# Altium project sonar_board_rev_2013A.PrjPcb
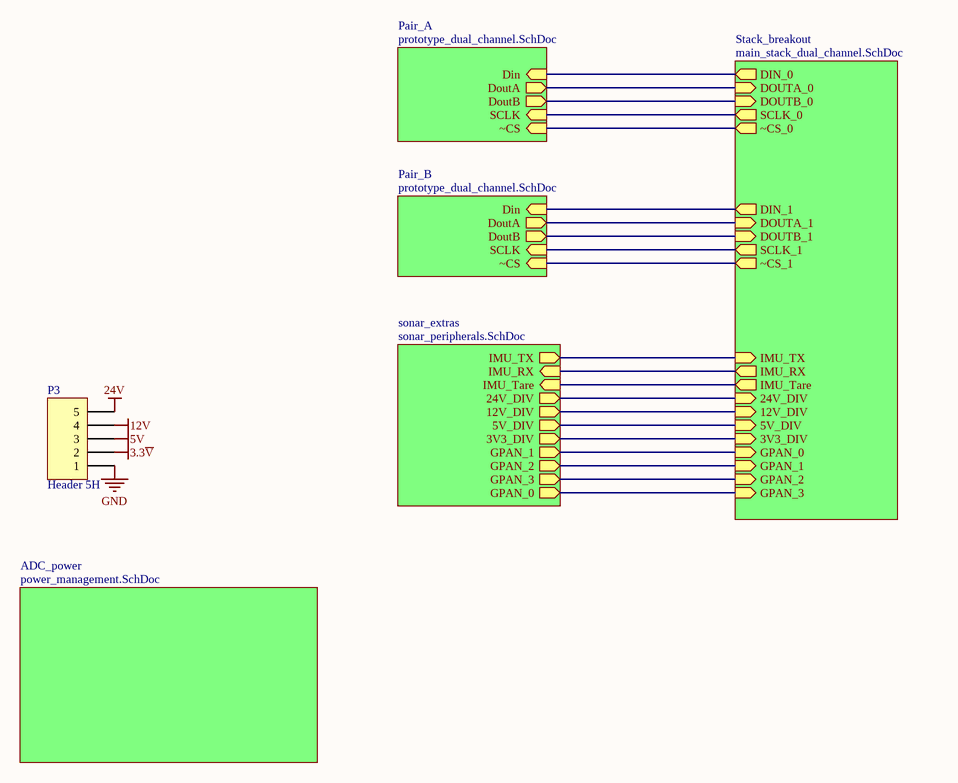
[diagram p0: sonar_board_rev_2013A.SchDoc]
8 sheets, 151 parts. Net scope: hierarchical (ports join the sheet entries above them; power ports are global).
Sheets:
  sonar_board_rev_2013A.SchDoc
    Pair_A = prototype_dual_channel.SchDoc
      Single_channel_VMA = voltage_mode_preamplifier.SchDoc
      Single_channel_VMA2 = voltage_mode_preamplifier.SchDoc
      Sallen_key_LPF = Sallen_key_LPF.SchDoc
      Biasing_circuitry = bias_LNA.SchDoc
      Sallen_key_LPF = Sallen_key_LPF.SchDoc
      Biasing_circuitry = bias_LNA.SchDoc
    Pair_B = prototype_dual_channel.SchDoc
      Single_channel_VMA = voltage_mode_preamplifier.SchDoc
      Single_channel_VMA2 = voltage_mode_preamplifier.SchDoc
      Sallen_key_LPF = Sallen_key_LPF.SchDoc
      Biasing_circuitry = bias_LNA.SchDoc
      Sallen_key_LPF = Sallen_key_LPF.SchDoc
      Biasing_circuitry = bias_LNA.SchDoc
    Stack_breakout = main_stack_dual_channel.SchDoc
    ADC_power = power_management.SchDoc
    sonar_extras = sonar_peripherals.SchDoc

## Sheet sonar_board_rev_2013A.SchDoc
size A

### Parts
P3  Header 5H  [HDR1X5H]

### Sub-sheets
ADC_power = power_management.SchDoc: no entries
Pair_A = prototype_dual_channel.SchDoc: Din (in), DoutA (out), DoutB (out), SCLK (in), ~CS (in)
Pair_B = prototype_dual_channel.SchDoc: SCLK (in), ~CS (in), DoutA (out), DoutB (out), Din (in)
sonar_extras = sonar_peripherals.SchDoc: IMU_TX (out), IMU_RX (in), IMU_Tare (in), 24V_DIV (out), 12V_DIV (out), 5V_DIV (out), 3V3_DIV (out), GPAN_1 (out), GPAN_2 (out), GPAN_3 (out), GPAN_0 (out)
Stack_breakout = main_stack_dual_channel.SchDoc: DIN_0 (out), DIN_1 (out), DOUTA_0 (in), DOUTA_1 (in), DOUTB_0 (in), DOUTB_1 (in), SCLK_0 (out), SCLK_1 (out), ~CS_0 (out), ~CS_1 (out), IMU_TX (in), IMU_RX (out), IMU_Tare (out), 24V_DIV (in), 12V_DIV (in), 5V_DIV (in), 3V3_DIV (in), GPAN_1 (in), GPAN_3 (in), GPAN_0 (in), GPAN_2 (in)

### Nets
3.3~{V}: P3.2
5V: P3.3
12V: P3.4
24V: P3.5
GND: P3.1
NetADC1_Pair_A_23: sheet Pair_A/Din, sheet Stack_breakout/DIN_0
NetADC1_Pair_A_31: sheet Pair_A/DoutB, sheet Stack_breakout/DOUTB_0
NetADC1_Pair_A_32: sheet Pair_A/DoutA, sheet Stack_breakout/DOUTA_0
NetADC1_Pair_A_34: sheet Pair_A/SCLK, sheet Stack_breakout/SCLK_0
NetADC1_Pair_A_35: sheet Pair_A/~CS, sheet Stack_breakout/~CS_0
NetADC1_Pair_B_23: sheet Pair_B/Din, sheet Stack_breakout/DIN_1
NetADC1_Pair_B_31: sheet Pair_B/DoutB, sheet Stack_breakout/DOUTB_1
NetADC1_Pair_B_32: sheet Pair_B/DoutA, sheet Stack_breakout/DOUTA_1
NetADC1_Pair_B_34: sheet Pair_B/SCLK, sheet Stack_breakout/SCLK_1
NetADC1_Pair_B_35: sheet Pair_B/~CS, sheet Stack_breakout/~CS_1
NetC25_2: sheet Stack_breakout/GPAN_3, sheet sonar_extras/GPAN_0
NetC26_2: sheet Stack_breakout/24V_DIV, sheet sonar_extras/24V_DIV
NetC27_2: sheet Stack_breakout/GPAN_0, sheet sonar_extras/GPAN_1
NetC28_2: sheet Stack_breakout/12V_DIV, sheet sonar_extras/12V_DIV
NetC29_2: sheet Stack_breakout/GPAN_1, sheet sonar_extras/GPAN_2
NetC30_2: sheet Stack_breakout/5V_DIV, sheet sonar_extras/5V_DIV
NetC31_2: sheet Stack_breakout/GPAN_2, sheet sonar_extras/GPAN_3
NetC32_2: sheet Stack_breakout/3V3_DIV, sheet sonar_extras/3V3_DIV
NetMS1_23: sheet Stack_breakout/IMU_Tare, sheet sonar_extras/IMU_Tare
NetMS1_24: sheet Stack_breakout/IMU_RX, sheet sonar_extras/IMU_RX
NetP4_3: sheet Stack_breakout/IMU_TX, sheet sonar_extras/IMU_TX

### Library data of the parts
P3 = Header 5H: Header, 5-Pin, Right Angle; LatestRevisionDate: 17-Jul-2002; LatestRevisionNote: Re-released for DXP Platform.; Publisher: Altium Limited

## Sheet prototype_dual_channel.SchDoc
size A
Used 2 times, as channels Pair_A, Pair_B. Parts and nets are listed once, with the designators drawn on the sheet.
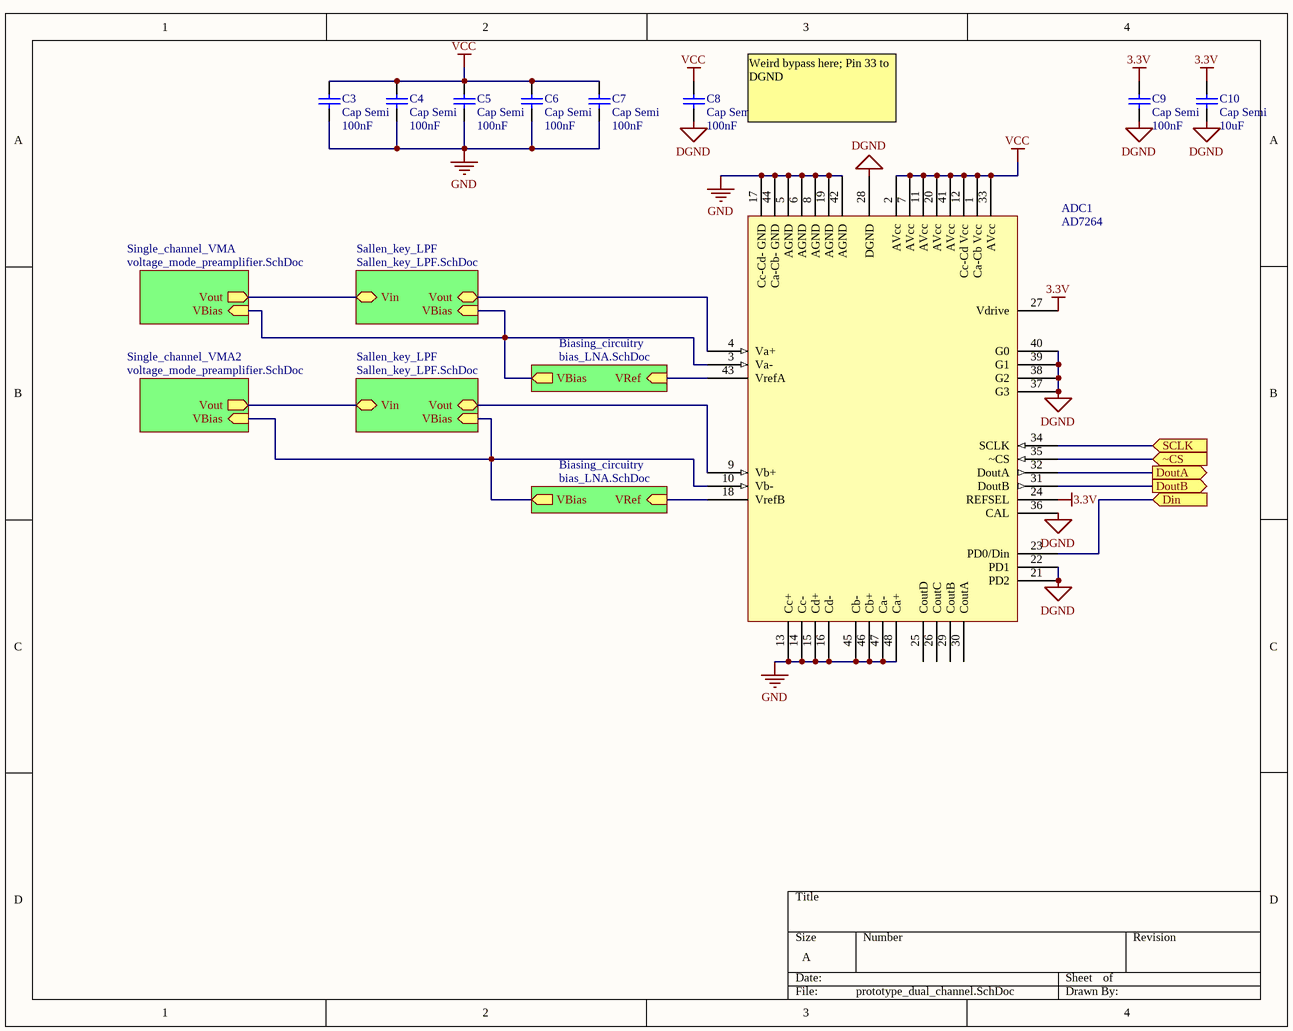
[diagram p1: prototype_dual_channel.SchDoc]

### Parts
ADC1  AD7264  [TSQFP50P900X900-48N]
C3  Cap Semi  value 100nF  [C0805]
C4  Cap Semi  value 100nF  [C0805]
C5  Cap Semi  value 100nF  [C0805]
C6  Cap Semi  value 100nF  [C0805]
C7  Cap Semi  value 100nF  [C0805]
C8  Cap Semi  value 100nF  [C0805]
C9  Cap Semi  value 100nF  [C0805]
C10  Cap Semi  value 10uF  [C0805]

### Sub-sheets
Biasing_circuitry = bias_LNA.SchDoc: VRef (in), VBias (out)
Biasing_circuitry = bias_LNA.SchDoc: VRef (in), VBias (out)
Sallen_key_LPF = Sallen_key_LPF.SchDoc: VBias (in), Vin, Vout
Sallen_key_LPF = Sallen_key_LPF.SchDoc: VBias (in), Vin, Vout
Single_channel_VMA = voltage_mode_preamplifier.SchDoc: Vout (out), VBias (in)
Single_channel_VMA2 = voltage_mode_preamplifier.SchDoc: Vout (out), VBias (in)

### Ports
Din (in), DoutA (out), DoutB (out), SCLK (in), ~CS (in)

### Nets
3.3V: ADC1.24(REFSEL) ADC1.27(Vdrive) C9.2 C10.2
DGND: ADC1.21(PD2) ADC1.22(PD1) ADC1.28(DGND) ADC1.36(CAL) ADC1.37(G3) ADC1.38(G2) ADC1.39(G1) ADC1.40(G0) C8.1 C9.1 C10.1
GND: ADC1.5(AGND) ADC1.6(AGND) ADC1.8(AGND) ADC1.13(Cc+) ADC1.14(Cc-) ADC1.15(Cd+) ADC1.16(Cd-) ADC1.17(Cc-Cd-_GND) ADC1.19(AGND) ADC1.42(AGND) ADC1.44(Ca-Cb-_GND) ADC1.45(Cb-) ADC1.46(Cb+) ADC1.47(Ca-) ADC1.48(Ca+) C3.1 C4.1 C5.1 C6.1 C7.1
VCC: ADC1.1(Ca-Cb_Vcc) ADC1.2(AVcc) ADC1.7(AVcc) ADC1.11(AVcc) ADC1.12(Cc-Cd_Vcc) ADC1.20(AVcc) ADC1.33(AVcc) ADC1.41(AVcc) C3.2 C4.2 C5.2 C6.2 C7.2 C8.2
Din: ADC1.23(PD0/Din) ; port Din
DoutA: ADC1.32(DoutA) ; port DoutA
DoutB: ADC1.31(DoutB) ; port DoutB
SCLK: ADC1.34(SCLK) ; port SCLK
~CS: ADC1.35(~CS) ; port ~CS
NetADC1_3: ADC1.3(Va-) ; sheet Single_channel_VMA/VBias, sheet Sallen_key_LPF/VBias, sheet Biasing_circuitry/VBias
NetADC1_4: ADC1.4(Va+) ; sheet Sallen_key_LPF/Vout
NetADC1_9: ADC1.9(Vb+) ; sheet Sallen_key_LPF/Vout
NetADC1_10: ADC1.10(Vb-) ; sheet Single_channel_VMA2/VBias, sheet Sallen_key_LPF/VBias, sheet Biasing_circuitry/VBias
NetADC1_18: ADC1.18(VrefB) ; sheet Biasing_circuitry/VRef
NetADC1_43: ADC1.43(VrefA) ; sheet Biasing_circuitry/VRef
(unnamed): sheet Single_channel_VMA/Vout, sheet Sallen_key_LPF/Vin
(unnamed): sheet Single_channel_VMA2/Vout, sheet Sallen_key_LPF/Vin

Not connected (* = marked no-connect by the designer): ADC1 25(CoutD) 26(CoutC) 29(CoutB) 30(CoutA)

### Channels
Pair_A: designators end in _Pair_A; ports Din=NetADC1_Pair_A_23 DoutA=NetADC1_Pair_A_32 DoutB=NetADC1_Pair_A_31 SCLK=NetADC1_Pair_A_34 ~CS=NetADC1_Pair_A_35
Pair_B: designators end in _Pair_B; ports Din=NetADC1_Pair_B_23 DoutA=NetADC1_Pair_B_32 DoutB=NetADC1_Pair_B_31 SCLK=NetADC1_Pair_B_34 ~CS=NetADC1_Pair_B_35

### Notes on the sheet
- Weird bypass here; Pin 33 to DGND

### Library data of the parts
ADC1 = AD7264: AD7264 - 14 bit 1MSPS 2 channel ADC
C3-C10 = Cap Semi: Capacitor (Semiconductor SIM Model); Published: 8-Jun-2000; LatestRevisionDate: 29-May-2009; LatestRevisionNote: IPC-7351 Footprint Added.; PackageReference: C1206; Publisher: Altium Limited; PackageDescription: Chip Capacitor

## Sheet voltage_mode_preamplifier.SchDoc
size A
Used 4 times, as channels Pair_A/Single_channel_VMA, Pair_A/Single_channel_VMA2, Pair_B/Single_channel_VMA, Pair_B/Single_channel_VMA2. Parts and nets are listed once, with the designators drawn on the sheet.
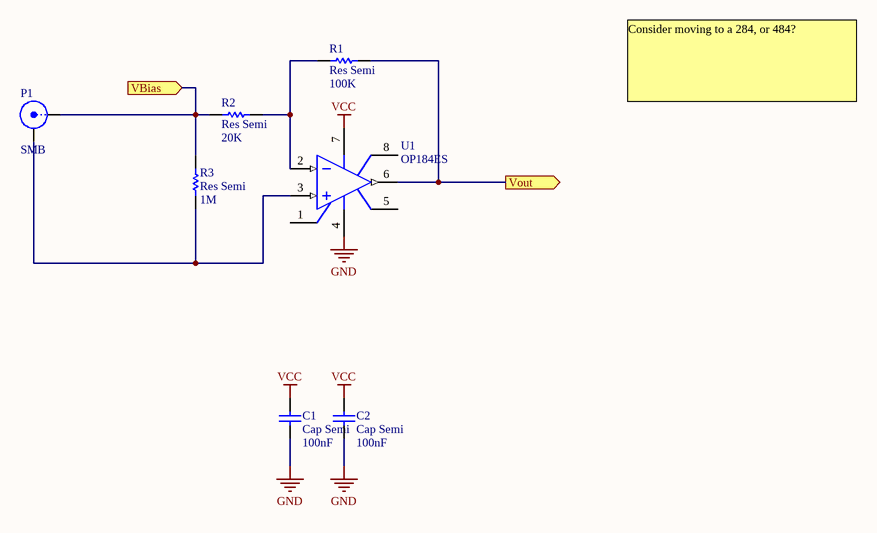
[diagram p2: voltage_mode_preamplifier.SchDoc]

### Parts
C1  Cap Semi  value 100nF  [C0805]
C2  Cap Semi  value 100nF  [C0805]
P1  SMB  [SMB_V-RJ45]
R1  Res Semi  value 100K  [RESC2012L]
R2  Res Semi  value 20K  [RESC2012L]
R3  Res Semi  value 1M  [RESC2012L]
U1  OP184ES  [SO-8_N]

### Ports
VBias (in), Vout (out)

### Nets
GND: C1.1 C2.1 U1.4(V-)
VCC: C1.2 C2.2 U1.7(V+)
VBias: P1.1(X) R2.1 R3.2 ; port VBias
Vout: R1.2 U1.6(OUT) ; port Vout
NetP1_2: P1.2(Y) R3.1 U1.3(IN+)
NetR1_1: R1.1 R2.2 U1.2(IN-)

Not connected (* = marked no-connect by the designer): U1 1(NUL) 5(NUL) 8(NC)

### Channels
Pair_A/Single_channel_VMA: designators end in _Pair_A_Single_channel_VMA; ports VBias=NetADC1_Pair_A_3 Vout=NetR1_Pair_A_Single_channel_VMA_2
Pair_A/Single_channel_VMA2: designators end in _Pair_A_Single_channel_VMA2; ports VBias=NetADC1_Pair_A_10 Vout=NetR1_Pair_A_Single_channel_VMA2_2
Pair_B/Single_channel_VMA: designators end in _Pair_B_Single_channel_VMA; ports VBias=NetADC1_Pair_B_3 Vout=NetR1_Pair_B_Single_channel_VMA_2
Pair_B/Single_channel_VMA2: designators end in _Pair_B_Single_channel_VMA2; ports VBias=NetADC1_Pair_B_10 Vout=NetR1_Pair_B_Single_channel_VMA2_2

### Notes on the sheet
- Consider moving to a 284, or 484?

### Library data of the parts
C1 C2 = Cap Semi: Capacitor (Semiconductor SIM Model); Published: 8-Jun-2000; LatestRevisionDate: 29-May-2009; LatestRevisionNote: IPC-7351 Footprint Added.; PackageReference: C1206; Publisher: Altium Limited; PackageDescription: Chip Capacitor
P1 = SMB: SMB Straight Connector; LatestRevisionDate: 17-Jul-2002; LatestRevisionNote: Re-released for DXP Platform.; Publisher: Altium Limited
R1-R3 = Res Semi: Semiconductor Resistor; Published: 8-Jun-2000; LatestRevisionDate: 17-Jul-2002; LatestRevisionNote: Re-released for DXP Platform.; PackageReference: AXIAL-0.5; Publisher: Altium Limited
U1 = OP184ES: Precision Rail-to-Rail Input and Ouput Operational Amplifier; Note: Pin 8 is not connected.; Published: 8-Jun-2000; LatestRevisionDate: 13-Apr-2006; LatestRevisionNote: IPC-7351 Footprint Added.; DatasheetVersion: REV. 0 1996; PackageVersion: revA; PackageReference: SO-8; Publisher: Altium Limited; PackageDescription: 8-Pin Small Outline Integrated Circuit 1.27 mm Pitch; Code_JEDEC: MS-012-AA; Code_IPC: SOIC127P600-8; ComponentLink1Description: Manufacturer Link; ComponentLink1URL: http://www.analog.com/en/prod/0,,759_786_OP184%2C00.html; ComponentLink2Description: Datasheet; ComponentLink2URL: http://www.analog.com/UploadedFiles/Data_Sheets/390492658OP184_284_484_b.pdf; Digikey PN: OP184FSZ-REEL7CT-ND

## Sheet Sallen_key_LPF.SchDoc
size A
Used 4 times, as channels Pair_A/Sallen_key_LPF, Pair_A/Sallen_key_LPF, Pair_B/Sallen_key_LPF, Pair_B/Sallen_key_LPF. Parts and nets are listed once, with the designators drawn on the sheet.
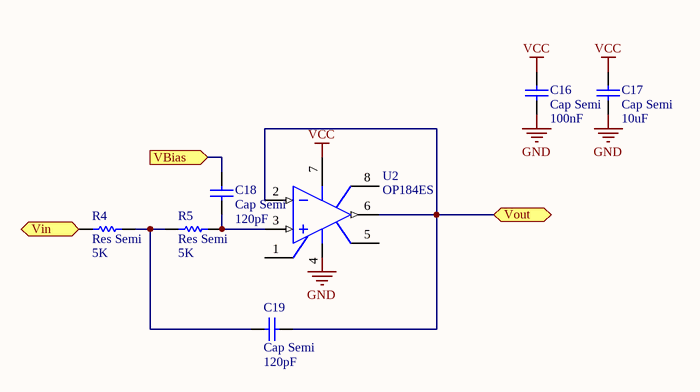
[diagram p3: Sallen_key_LPF.SchDoc]

### Parts
C16  Cap Semi  value 100nF  [C0805]
C17  Cap Semi  value 10uF  [C0805]
C18  Cap Semi  value 120pF  [C0805]
C19  Cap Semi  value 120pF  [C0805]
R4  Res Semi  value 5K  [RESC2012L]
R5  Res Semi  value 5K  [RESC2012L]
U2  OP184ES  [SO-8_N]

### Ports
VBias (in), Vin, Vout

### Nets
GND: C16.1 C17.1
VCC: C16.2 C17.2 U2.7(V+)
VBias: C18.2 ; port VBias
Vin: R4.1 ; port Vin
Vout: C19.1 U2.2(IN-) U2.6(OUT) ; port Vout
NetC18_1: C18.1 R5.2 U2.3(IN+)
NetC19_2: C19.2 R4.2 R5.1

Not connected (* = marked no-connect by the designer): U2 1(NUL) 4(V-) 5(NUL) 8(NC)

### Channels
Pair_A/Sallen_key_LPF: designators end in _Pair_A_Sallen_key_LPF#1; ports VBias=NetADC1_Pair_A_3 Vin=NetR1_Pair_A_Single_channel_VMA_2 Vout=NetADC1_Pair_A_4
Pair_A/Sallen_key_LPF: designators end in _Pair_A_Sallen_key_LPF#2; ports VBias=NetADC1_Pair_A_10 Vin=NetR1_Pair_A_Single_channel_VMA2_2 Vout=NetADC1_Pair_A_9
Pair_B/Sallen_key_LPF: designators end in _Pair_B_Sallen_key_LPF#1; ports VBias=NetADC1_Pair_B_3 Vin=NetR1_Pair_B_Single_channel_VMA_2 Vout=NetADC1_Pair_B_4
Pair_B/Sallen_key_LPF: designators end in _Pair_B_Sallen_key_LPF#2; ports VBias=NetADC1_Pair_B_10 Vin=NetR1_Pair_B_Single_channel_VMA2_2 Vout=NetADC1_Pair_B_9

### Notes on the sheet
- Labels drawn without touching a wire or pin: GND

### Library data of the parts
C16-C19 = Cap Semi: Capacitor (Semiconductor SIM Model); Published: 8-Jun-2000; LatestRevisionDate: 29-May-2009; LatestRevisionNote: IPC-7351 Footprint Added.; PackageReference: C1206; Publisher: Altium Limited; PackageDescription: Chip Capacitor
R4 R5 = Res Semi: Semiconductor Resistor; Published: 8-Jun-2000; LatestRevisionDate: 17-Jul-2002; LatestRevisionNote: Re-released for DXP Platform.; PackageReference: AXIAL-0.5; Publisher: Altium Limited
U2 = OP184ES: as U1 on sheet voltage_mode_preamplifier; Published: 8-Jun-2000; LatestRevisionDate: 13-Apr-2006; LatestRevisionNote: IPC-7351 Footprint Added.; DatasheetVersion: REV. 0 1996; PackageVersion: revA; PackageReference: SO-8; Publisher: Altium Limited; PackageDescription: 8-Pin Small Outline Integrated Circuit 1.27 mm Pitch; Code_JEDEC: MS-012-AA; Code_IPC: SOIC127P600-8; ComponentLink1Description: Manufacturer Link; ComponentLink1URL: http://www.analog.com/en/prod/0,,759_786_OP184%2C00.html; ComponentLink2Description: Datasheet; ComponentLink2URL: http://www.analog.com/UploadedFiles/Data_Sheets/390492658OP184_284_484_b.pdf

## Sheet bias_LNA.SchDoc
size A
Used 4 times, as channels Pair_A/Biasing_circuitry, Pair_A/Biasing_circuitry, Pair_B/Biasing_circuitry, Pair_B/Biasing_circuitry. Parts and nets are listed once, with the designators drawn on the sheet.
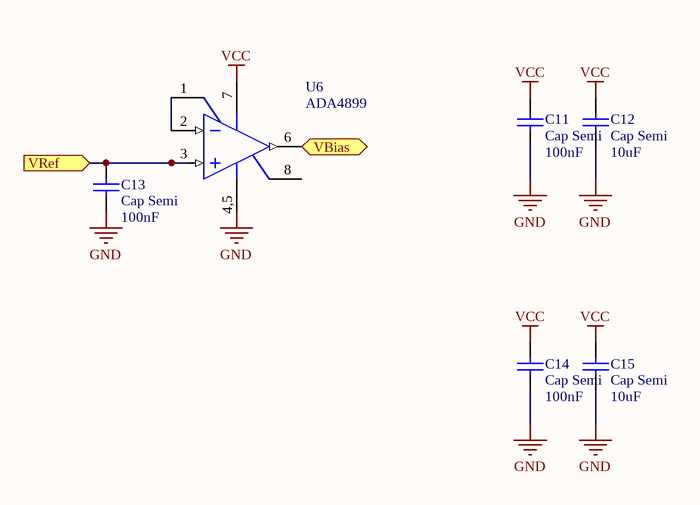
[diagram p4: bias_LNA.SchDoc]

### Parts
C11  Cap Semi  value 100nF  [C0805]
C12  Cap Semi  value 10uF  [C0805]
C13  Cap Semi  value 100nF  [C0805]
C14  Cap Semi  value 100nF  [C0805]
C15  Cap Semi  value 10uF  [C0805]
U6  ADA4899  [SO8_N]

### Ports
VBias (out), VRef (in)

### Nets
GND: C11.1 C12.1 C13.1 C14.1 C15.1 U6.4,5(V-)
VCC: C11.2 C12.2 C14.2 C15.2 U6.7(V+)
VBias: U6.6(OUT) ; port VBias
VRef: C13.2 U6.3(IN+) ; port VRef
NetU6_1: U6.1(FB) U6.2(IN-)

Not connected (* = marked no-connect by the designer): U6 8(CMPEN)

### Channels
Pair_A/Biasing_circuitry: designators end in _Pair_A_Biasing_circuitry#1; ports VBias=NetADC1_Pair_A_3 VRef=NetADC1_Pair_A_43
Pair_A/Biasing_circuitry: designators end in _Pair_A_Biasing_circuitry#2; ports VBias=NetADC1_Pair_A_10 VRef=NetADC1_Pair_A_18
Pair_B/Biasing_circuitry: designators end in _Pair_B_Biasing_circuitry#1; ports VBias=NetADC1_Pair_B_3 VRef=NetADC1_Pair_B_43
Pair_B/Biasing_circuitry: designators end in _Pair_B_Biasing_circuitry#2; ports VBias=NetADC1_Pair_B_10 VRef=NetADC1_Pair_B_18

### Library data of the parts
C11-C15 = Cap Semi: Capacitor (Semiconductor SIM Model); Published: 8-Jun-2000; LatestRevisionDate: 29-May-2009; LatestRevisionNote: IPC-7351 Footprint Added.; PackageReference: C1206; Publisher: Altium Limited; PackageDescription: Chip Capacitor
U6 = ADA4899: High Speed, Low Voltage Noise, Unity Gain Stable Op-Amp

## Sheet main_stack_dual_channel.SchDoc
size A
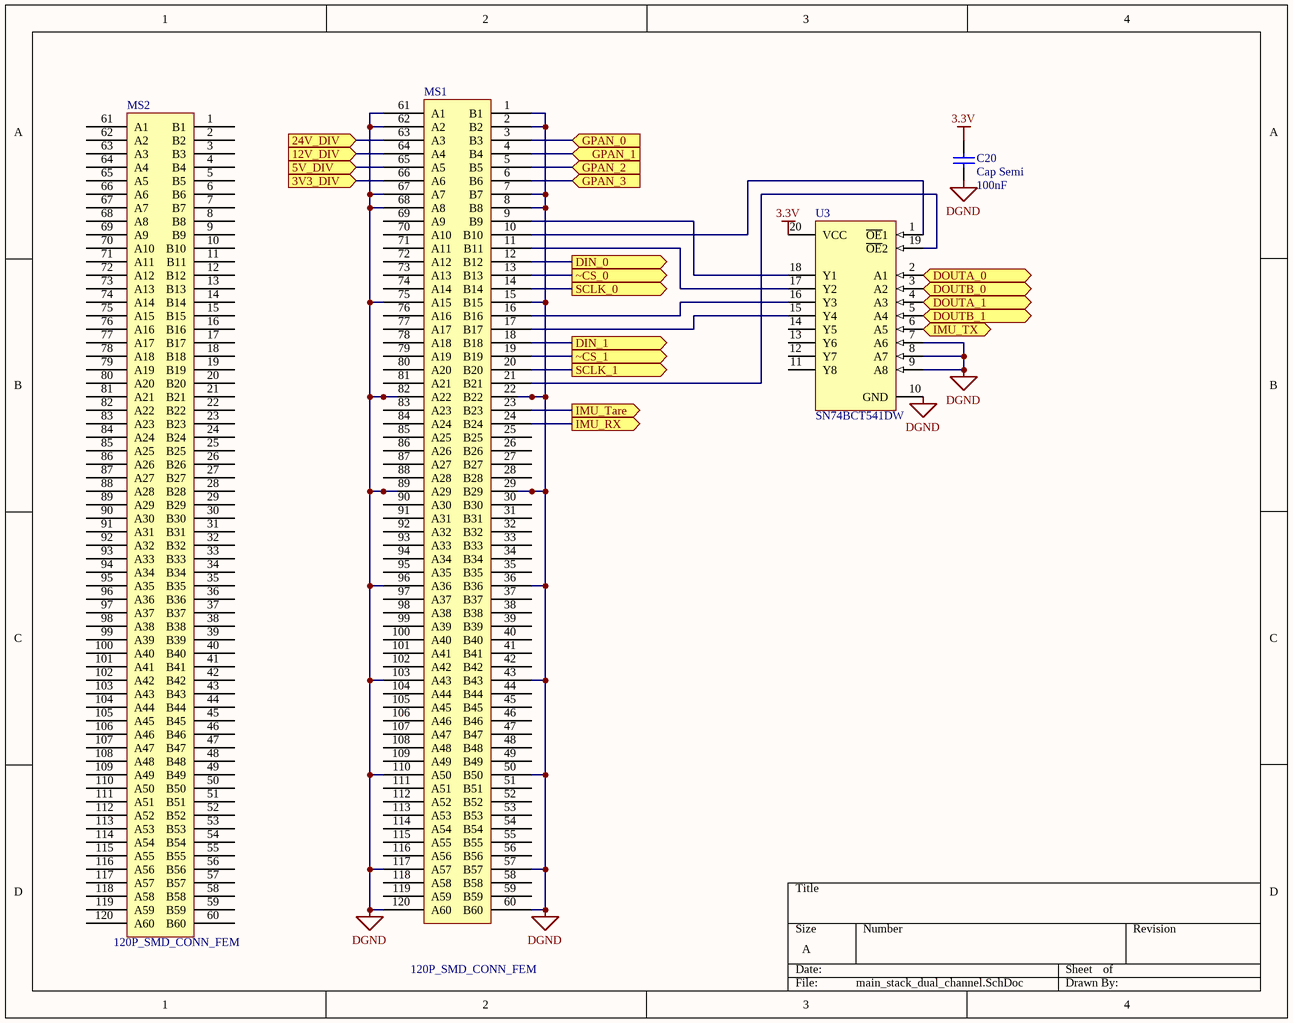
[diagram p5: main_stack_dual_channel.SchDoc]

### Parts
C20  Cap Semi  value 100nF  [C0805]
MS1  120P_SMD_CONN_FEM
MS2  120P_SMD_CONN_FEM
U3  SN74BCT541DW  [DW020_N]

### Ports
3V3_DIV (in), 5V_DIV (in), 12V_DIV (in), 24V_DIV (in), DIN_0 (out), DIN_1 (out), DOUTA_0 (in), DOUTA_1 (in), DOUTB_0 (in), DOUTB_1 (in), GPAN_0 (in), GPAN_1 (in), GPAN_2 (in), GPAN_3 (in), IMU_RX (out), IMU_Tare (out), IMU_TX (in), SCLK_0 (out), SCLK_1 (out), ~CS_0 (out), ~CS_1 (out)

### Nets
3.3V: C20.2 U3.20(VCC)
DGND: C20.1 MS1.1(B1) MS1.2(B2) MS1.7(B7) MS1.8(B8) MS1.15(B15) MS1.22(B22) MS1.29(B29) MS1.36(B36) MS1.43(B43) MS1.50(B50) MS1.57(B57) MS1.60(B60) MS1.61(A1) MS1.62(A2) MS1.67(A7) MS1.68(A8) MS1.75(A15) MS1.82(A22) MS1.89(A29) MS1.96(A36) MS1.103(A43) MS1.110(A50) MS1.117(A57) MS1.120(A60) U3.7(A6) U3.8(A7) U3.9(A8) U3.10(GND)
NetADC1_Pair_A_23: MS1.12(B12) ; port DIN_0
NetADC1_Pair_A_31: U3.3(A2) ; port DOUTB_0
NetADC1_Pair_A_32: U3.2(A1) ; port DOUTA_0
NetADC1_Pair_A_34: MS1.14(B14) ; port SCLK_0
NetADC1_Pair_A_35: MS1.13(B13) ; port ~CS_0
NetADC1_Pair_B_23: MS1.18(B18) ; port DIN_1
NetADC1_Pair_B_31: U3.5(A4) ; port DOUTB_1
NetADC1_Pair_B_32: U3.4(A3) ; port DOUTA_1
NetADC1_Pair_B_34: MS1.20(B20) ; port SCLK_1
NetADC1_Pair_B_35: MS1.19(B19) ; port ~CS_1
NetC25_2: MS1.6(B6) ; port GPAN_3
NetC26_2: MS1.63(A3) ; port 24V_DIV
NetC27_2: MS1.3(B3) ; port GPAN_0
NetC28_2: MS1.64(A4) ; port 12V_DIV
NetC29_2: MS1.4(B4) ; port GPAN_1
NetC30_2: MS1.65(A5) ; port 5V_DIV
NetC31_2: MS1.5(B5) ; port GPAN_2
NetC32_2: MS1.66(A6) ; port 3V3_DIV
NetMS1_9: MS1.9(B9) U3.18(Y1)
NetMS1_10: MS1.10(B10) U3.1(~{OE}1)
NetMS1_11: MS1.11(B11) U3.17(Y2)
NetMS1_16: MS1.16(B16) U3.16(Y3)
NetMS1_17: MS1.17(B17) U3.15(Y4)
NetMS1_21: MS1.21(B21) U3.19(~{OE}2)
NetMS1_23: MS1.23(B23) ; port IMU_Tare
NetMS1_24: MS1.24(B24) ; port IMU_RX
NetP4_3: U3.6(A5) ; port IMU_TX

Not connected (* = marked no-connect by the designer): MS1 25(B25) 26(B26) 27(B27) 28(B28) 30(B30) 31(B31) 32(B32) 33(B33) 34(B34) 35(B35) 37(B37) 38(B38) 39(B39) 40(B40) 41(B41) 42(B42) 44(B44) 45(B45) 46(B46) 47(B47) 48(B48) 49(B49) 51(B51) 52(B52) 53(B53) 54(B54) 55(B55) 56(B56) 58(B58) 59(B59) 69(A9) 70(A10) 71(A11) 72(A12) 73(A13) 74(A14) 76(A16) 77(A17) 78(A18) 79(A19) 80(A20) 81(A21) 83(A23) 84(A24) 85(A25) 86(A26) 87(A27) 88(A28) 90(A30) 91(A31) 92(A32) 93(A33) 94(A34) 95(A35) 97(A37) 98(A38) 99(A39) 100(A40) 101(A41) 102(A42) 104(A44) 105(A45) 106(A46) 107(A47) 108(A48) 109(A49) 111(A51) 112(A52) 113(A53) 114(A54) 115(A55) 116(A56) 118(A58) 119(A59); MS2 1(B1) 2(B2) 3(B3) 4(B4) 5(B5) 6(B6) 7(B7) 8(B8) 9(B9) 10(B10) 11(B11) 12(B12) 13(B13) 14(B14) 15(B15) 16(B16) 17(B17) 18(B18) 19(B19) 20(B20) 21(B21) 22(B22) 23(B23) 24(B24) 25(B25) 26(B26) 27(B27) 28(B28) 29(B29) 30(B30) 31(B31) 32(B32) 33(B33) 34(B34) 35(B35) 36(B36) 37(B37) 38(B38) 39(B39) 40(B40) 41(B41) 42(B42) 43(B43) 44(B44) 45(B45) 46(B46) 47(B47) 48(B48) 49(B49) 50(B50) 51(B51) 52(B52) 53(B53) 54(B54) 55(B55) 56(B56) 57(B57) 58(B58) 59(B59) 60(B60) 61(A1) 62(A2) 63(A3) 64(A4) 65(A5) 66(A6) 67(A7) 68(A8) 69(A9) 70(A10) 71(A11) 72(A12) 73(A13) 74(A14) 75(A15) 76(A16) 77(A17) 78(A18) 79(A19) 80(A20) 81(A21) 82(A22) 83(A23) 84(A24) 85(A25) 86(A26) 87(A27) 88(A28) 89(A29) 90(A30) 91(A31) 92(A32) 93(A33) 94(A34) 95(A35) 96(A36) 97(A37) 98(A38) 99(A39) 100(A40) 101(A41) 102(A42) 103(A43) 104(A44) 105(A45) 106(A46) 107(A47) 108(A48) 109(A49) 110(A50) 111(A51) 112(A52) 113(A53) 114(A54) 115(A55) 116(A56) 117(A57) 118(A58) 119(A59) 120(A60); U3 11(Y8) 12(Y7) 13(Y6) 14(Y5)

### Library data of the parts
C20 = Cap Semi: Capacitor (Semiconductor SIM Model); Published: 8-Jun-2000; LatestRevisionDate: 29-May-2009; LatestRevisionNote: IPC-7351 Footprint Added.; PackageReference: C1206; Publisher: Altium Limited; PackageDescription: Chip Capacitor
MS1 MS2 = 120P_SMD_CONN_FEM: Main Stack Connector, Female; Part Number: FX2-120P-1.27SV(71)
U3 = SN74BCT541DW: Octal Buffer/Driver with 3-State Outputs; ComponentAvailability: Obsolete; Published: 8-Jun-2000; LatestRevisionDate: 13-Apr-2006; LatestRevisionNote: IPC-7351 Footprint Added.; DatasheetVersion: Apr-1994; PackageVersion: Mar-2000; PackageReference: DW020; Publisher: Altium Limited; PackageDescription: 20-Pin Plastic Small Outline Integrated Circuit 1.27 mm Pitch; Code_JEDEC: MS-013; Code_IPC: SOIC127P1030-20; ComponentLink1Description: Manufacturer Link; ComponentLink1URL: http://www.ti.com/; ComponentLink2Description: Discontinuation Notice; ComponentLink2URL: http://focus.ti.com/docs/prod/folders/print/sn74bct541.html

## Sheet power_management.SchDoc
size A
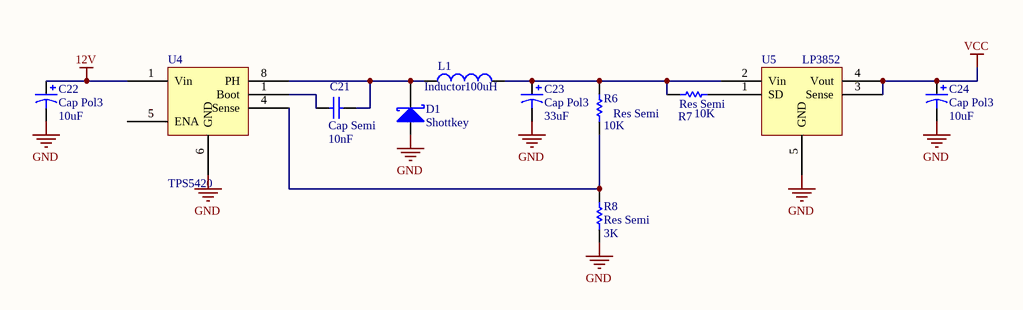
[diagram p6: power_management.SchDoc]

### Parts
C21  Cap Semi  value 10nF  [C0805]
C22  Cap Pol3  value 10uF  [TC6032-2412]
C23  Cap Pol3  value 33uF  [TC6032-2412]
C24  Cap Pol3  value 10uF  [TC3216-1206]
D1  Shottkey  [TO-220AC]
L1  Inductor  value 100uH  [SB_IND]
R6  Res Semi  value 10K  [RESC2012L]
R7  Res Semi  value 10K  [RESC2012L]
R8  Res Semi  value 3K  [RESC2012L]
U4  TPS5420  [SO8_N]
U5  LP3852  [SOT223-5N]

### Nets
12V: C22.1 U4.1(Vin)
GND: C22.2 C23.2 C24.2 R8.1 U4.6(GND) U5.5(GND)
VCC: C24.1 U5.3(Sense) U5.4(Vout)
NetC21_1: C21.1 U4.1(Boot)
NetC21_2: C21.2 D1.1(K) L1.1 U4.8(PH)
NetC23_1: C23.1 L1.2 R6.2 R7.1 U5.2(Vin)
NetR6_1: R6.1 R8.2 U4.4(Sense)
NetR7_2: R7.2 U5.1(SD)

Not connected (* = marked no-connect by the designer): D1 3(A); U4 5(ENA)

### Notes on the sheet
- Labels drawn without touching a wire or pin: GND

### Library data of the parts
C21 = Cap Semi: Capacitor (Semiconductor SIM Model); Published: 8-Jun-2000; LatestRevisionDate: 29-May-2009; LatestRevisionNote: IPC-7351 Footprint Added.; PackageReference: C1206; Publisher: Altium Limited; PackageDescription: Chip Capacitor
C22-C24 = Cap Pol3: Polarized Capacitor (Surface Mount); Published: 8-Jun-2000; LatestRevisionDate: 29-May-2009; LatestRevisionNote: IPC-7351 Footprint Added.; PackageReference: C0805; Publisher: Altium Limited; PackageDescription: Chip Capacitor
  C22: Digikey PN: 718-1052-6-ND
  C23: Digikey PN: 718-1077-1-ND
D1 = Diode 10TQ035: Schottky Rectifier; Note: Terminal 2 is the TAB and is electrically connected to the cathode; Published: 8-Jun-2000; LatestRevisionDate: 17-Jul-2002; LatestRevisionNote: Re-released for DXP Platform.; DatasheetVersion: PD-2.057B; PackageVersion: Feb-1998; PackageReference: TO-220AC; Publisher: Altium Limited; PackageDescription: TO, Thru-Hole, Vertical, Heatsink Mounted; 3 In-Line Leads (1 Absent); Pitch 2.54 mm; ComponentLink1Description: Manufacturer Link; ComponentLink1URL: http://www.irf.com/; ComponentLink2Description: Datasheet; ComponentLink2URL: http://www.irf.com/product-info/datasheets/data/10tq.pdf; Digikey PN: B340A-FDICT-ND
L1 = Inductor: Code_IEC: 1005; Published: 8-Jun-2000; LatestRevisionDate: 29-May-2009; LatestRevisionNote: IPC-7351 Footprint Added.; PackageReference: 0402-A; Publisher: Altium Limited; PackageDescription: Chip Inductor; Code_JEITA: 0402; Digikey PN: 495-1987-1-ND
R6-R8 = Res Semi: Semiconductor Resistor; Published: 8-Jun-2000; LatestRevisionDate: 17-Jul-2002; LatestRevisionNote: Re-released for DXP Platform.; PackageReference: AXIAL-0.5; Publisher: Altium Limited
  R6 R8: PackageDescription: Axial Device, Thru-Hole; 2 Leads; 0.5 in Pin Spacing
U4 = TPS5420: 2A Wide Input Range Step-Down Swift Converter; Digikey PN: 296-35989-1-ND
U5 = LP3852: 1.5A Fast Response Ultra Low Dropout Linear Regulator; Digikey PN: LP3852EMP-5.0/NOPBCT-ND

## Sheet sonar_peripherals.SchDoc
size A
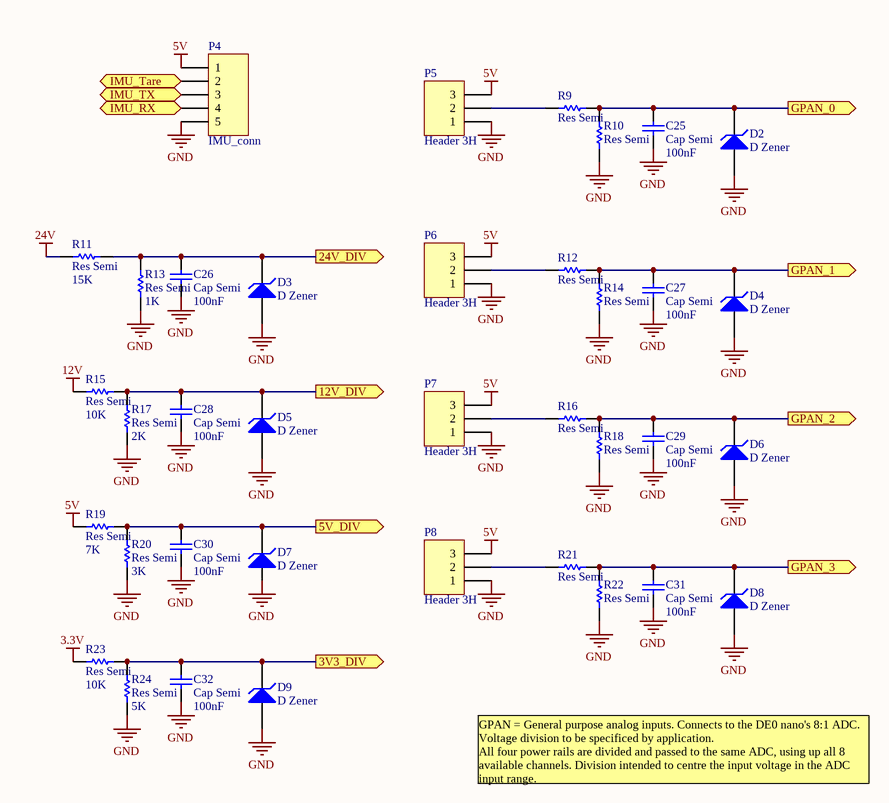
[diagram p7: sonar_peripherals.SchDoc]

### Parts
C25  Cap Semi  value 100nF  [C0805]
C26  Cap Semi  value 100nF  [C0805]
C27  Cap Semi  value 100nF  [C0805]
C28  Cap Semi  value 100nF  [C0805]
C29  Cap Semi  value 100nF  [C0805]
C30  Cap Semi  value 100nF  [C0805]
C31  Cap Semi  value 100nF  [C0805]
C32  Cap Semi  value 100nF  [C0805]
D2  D Zener  [SOD-323]
D3  D Zener  [SOD-323]
D4  D Zener  [SOD-323]
D5  D Zener  [SOD-323]
D6  D Zener  [SOD-323]
D7  D Zener  [SOD-323]
D8  D Zener  [SOD-323]
D9  D Zener  [SOD-323]
P4  IMU_conn  [HDR1X5H]
P5  Header 3H  [HDR1X3H]
P6  Header 3H  [HDR1X3H]
P7  Header 3H  [HDR1X3H]
P8  Header 3H  [HDR1X3H]
R9  Res Semi  [RESC2012L]
R10  Res Semi  [RESC2012L]
R11  Res Semi  value 15K  [RESC2012L]
R12  Res Semi  [RESC2012L]
R13  Res Semi  value 1K  [RESC2012L]
R14  Res Semi  [RESC2012L]
R15  Res Semi  value 10K  [RESC2012L]
R16  Res Semi  [RESC2012L]
R17  Res Semi  value 2K  [RESC2012L]
R18  Res Semi  [RESC2012L]
R19  Res Semi  value 7K  [RESC2012L]
R20  Res Semi  value 3K  [RESC2012L]
R21  Res Semi  [RESC2012L]
R22  Res Semi  [RESC2012L]
R23  Res Semi  value 10K  [RESC2012L]
R24  Res Semi  value 5K  [RESC2012L]

### Ports
3V3_DIV (out), 5V_DIV (out), 12V_DIV (out), 24V_DIV (out), GPAN_0 (out), GPAN_1 (out), GPAN_2 (out), GPAN_3 (out), IMU_RX (in), IMU_Tare (in), IMU_TX (out)

### Nets
3.3V: R23.1
5V: P4.1 P5.3 P6.3 P7.3 P8.3 R19.1
12V: R15.1
24V: R11.1
GND: C25.1 C26.1 C27.1 C28.1 C29.1 C30.1 C31.1 C32.1 D2.1(A) D3.1(A) D4.1(A) D5.1(A) D6.1(A) D8.1(A) D9.1(A) P4.5 P5.1 P6.1 P7.1 P8.1 R10.1 R13.1 R14.1 R17.1 R18.1 R20.1 R22.1 R24.1
NetC25_2: C25.2 D2.2(K) R9.2 R10.2 ; port GPAN_0
NetC26_2: C26.2 D3.2(K) R11.2 R13.2 ; port 24V_DIV
NetC27_2: C27.2 D4.2(K) R12.2 R14.2 ; port GPAN_1
NetC28_2: C28.2 D5.2(K) R15.2 R17.2 ; port 12V_DIV
NetC29_2: C29.2 D6.2(K) R16.2 R18.2 ; port GPAN_2
NetC30_2: C30.2 D7.2(K) R19.2 R20.2 ; port 5V_DIV
NetC31_2: C31.2 D8.2(K) R21.2 R22.2 ; port GPAN_3
NetC32_2: C32.2 D9.2(K) R23.2 R24.2 ; port 3V3_DIV
NetMS1_23: P4.2 ; port IMU_Tare
NetMS1_24: P4.4 ; port IMU_RX
NetP4_3: P4.3 ; port IMU_TX
NetP5_2: P5.2 R9.1
NetP6_2: P6.2 R12.1
NetP7_2: P7.2 R16.1
NetP8_2: P8.2 R21.1

Not connected (* = marked no-connect by the designer): D7 1(A)

### Notes on the sheet
- GPAN = General purpose analog inputs. Connects to the DE0 nano's 8:1 ADC.  Voltage division to be specificed by application.
  All four power rails are divided and passed to the same ADC, using up all 8 available channels. Division intended to centre the input voltage in the ADC input range.
- Labels drawn without touching a wire or pin: GND

### Library data of the parts
C25-C32 = Cap Semi: Capacitor (Semiconductor SIM Model); Published: 8-Jun-2000; LatestRevisionDate: 29-May-2009; LatestRevisionNote: IPC-7351 Footprint Added.; PackageReference: C1206; Publisher: Altium Limited; PackageDescription: Chip Capacitor
D2-D9 = D Zener: Zener Diode; Published: 8-Jun-2000; LatestRevisionDate: 17-Jul-2002; LatestRevisionNote: Re-released for DXP Platform.; PackageReference: DIODE-0.7; Publisher: Altium Limited; PackageDescription: Diode, Thru-Hole; 2 Leads; 0.7 in Pin Spacing
P4 = Header 5H: Header, 5-Pin, Right Angle; LatestRevisionDate: 17-Jul-2002; LatestRevisionNote: Re-released for DXP Platform.; Publisher: Altium Limited
P5-P8 = Header 3H: Header, 3-Pin, Right Angle; LatestRevisionDate: 17-Jul-2002; LatestRevisionNote: Re-released for DXP Platform.; Publisher: Altium Limited
R9 R12 R16 R21 = Res Semi: Semiconductor Resistor; Value: 10K; Published: 8-Jun-2000; LatestRevisionDate: 17-Jul-2002; LatestRevisionNote: Re-released for DXP Platform.; PackageReference: AXIAL-0.5; Publisher: Altium Limited; PackageDescription: Axial Device, Thru-Hole; 2 Leads; 0.5 in Pin Spacing
R10 R14 R18 R22 = Res Semi: Semiconductor Resistor; Value: 2K; Published: 8-Jun-2000; LatestRevisionDate: 17-Jul-2002; LatestRevisionNote: Re-released for DXP Platform.; PackageReference: AXIAL-0.5; Publisher: Altium Limited; PackageDescription: Axial Device, Thru-Hole; 2 Leads; 0.5 in Pin Spacing
R11 R13 R15 R17 R19 R20 R23 R24 = Res Semi: Semiconductor Resistor; Published: 8-Jun-2000; LatestRevisionDate: 17-Jul-2002; LatestRevisionNote: Re-released for DXP Platform.; PackageReference: AXIAL-0.5; Publisher: Altium Limited; PackageDescription: Axial Device, Thru-Hole; 2 Leads; 0.5 in Pin Spacing

## Nets that join several sheets
3.3V: Pair_A (ADC1_Pair_A.24 ADC1_Pair_A.27 C9_Pair_A.2 C10_Pair_A.2), Pair_B (ADC1_Pair_B.24 ADC1_Pair_B.27 C9_Pair_B.2 C10_Pair_B.2), main_stack_dual_channel (C20.2 U3.20), sonar_peripherals (R23.1)
5V: sonar_board_rev_2013A (P3.3), sonar_peripherals (6 pins)
12V: sonar_board_rev_2013A (P3.4), power_management (C22.1 U4.1), sonar_peripherals (R15.1)
24V: sonar_board_rev_2013A (P3.5), sonar_peripherals (R11.1)
DGND: Pair_A (11 pins), Pair_B (11 pins), main_stack_dual_channel (29 pins)
GND: sonar_board_rev_2013A (P3.1), Pair_A (20 pins), Pair_A/Single_channel_VMA (C1_Pair_A_Single_channel_VMA.1 C2_Pair_A_Single_channel_VMA.1 U1_Pair_A_Single_channel_VMA.4), Pair_A/Single_channel_VMA2 (C1_Pair_A_Single_channel_VMA2.1 C2_Pair_A_Single_channel_VMA2.1 U1_Pair_A_Single_channel_VMA2.4), Pair_A/Sallen_key_LPF (C16_Pair_A_Sallen_key_LPF#1.1 C17_Pair_A_Sallen_key_LPF#1.1), Pair_A/Biasing_circuitry (6 pins), Pair_A/Sallen_key_LPF (C16_Pair_A_Sallen_key_LPF#2.1 C17_Pair_A_Sallen_key_LPF#2.1), Pair_A/Biasing_circuitry (6 pins), Pair_B (20 pins), Pair_B/Single_channel_VMA (C1_Pair_B_Single_channel_VMA.1 C2_Pair_B_Single_channel_VMA.1 U1_Pair_B_Single_channel_VMA.4), Pair_B/Single_channel_VMA2 (C1_Pair_B_Single_channel_VMA2.1 C2_Pair_B_Single_channel_VMA2.1 U1_Pair_B_Single_channel_VMA2.4), Pair_B/Sallen_key_LPF (C16_Pair_B_Sallen_key_LPF#1.1 C17_Pair_B_Sallen_key_LPF#1.1), Pair_B/Biasing_circuitry (6 pins), Pair_B/Sallen_key_LPF (C16_Pair_B_Sallen_key_LPF#2.1 C17_Pair_B_Sallen_key_LPF#2.1), Pair_B/Biasing_circuitry (6 pins), power_management (6 pins), sonar_peripherals (28 pins)
VCC: Pair_A (14 pins), Pair_A/Single_channel_VMA (C1_Pair_A_Single_channel_VMA.2 C2_Pair_A_Single_channel_VMA.2 U1_Pair_A_Single_channel_VMA.7), Pair_A/Single_channel_VMA2 (C1_Pair_A_Single_channel_VMA2.2 C2_Pair_A_Single_channel_VMA2.2 U1_Pair_A_Single_channel_VMA2.7), Pair_A/Sallen_key_LPF (C16_Pair_A_Sallen_key_LPF#1.2 C17_Pair_A_Sallen_key_LPF#1.2 U2_Pair_A_Sallen_key_LPF#1.7), Pair_A/Biasing_circuitry (5 pins), Pair_A/Sallen_key_LPF (C16_Pair_A_Sallen_key_LPF#2.2 C17_Pair_A_Sallen_key_LPF#2.2 U2_Pair_A_Sallen_key_LPF#2.7), Pair_A/Biasing_circuitry (5 pins), Pair_B (14 pins), Pair_B/Single_channel_VMA (C1_Pair_B_Single_channel_VMA.2 C2_Pair_B_Single_channel_VMA.2 U1_Pair_B_Single_channel_VMA.7), Pair_B/Single_channel_VMA2 (C1_Pair_B_Single_channel_VMA2.2 C2_Pair_B_Single_channel_VMA2.2 U1_Pair_B_Single_channel_VMA2.7), Pair_B/Sallen_key_LPF (C16_Pair_B_Sallen_key_LPF#1.2 C17_Pair_B_Sallen_key_LPF#1.2 U2_Pair_B_Sallen_key_LPF#1.7), Pair_B/Biasing_circuitry (5 pins), Pair_B/Sallen_key_LPF (C16_Pair_B_Sallen_key_LPF#2.2 C17_Pair_B_Sallen_key_LPF#2.2 U2_Pair_B_Sallen_key_LPF#2.7), Pair_B/Biasing_circuitry (5 pins), power_management (C24.1 U5.3 U5.4)
NetADC1_Pair_A_3: Pair_A (ADC1_Pair_A.3), Pair_A/Single_channel_VMA (P1_Pair_A_Single_channel_VMA.1 R2_Pair_A_Single_channel_VMA.1 R3_Pair_A_Single_channel_VMA.2), Pair_A/Sallen_key_LPF (C18_Pair_A_Sallen_key_LPF#1.2), Pair_A/Biasing_circuitry (U6_Pair_A_Biasing_circuitry#1.6)
NetADC1_Pair_A_4: Pair_A (ADC1_Pair_A.4), Pair_A/Sallen_key_LPF (C19_Pair_A_Sallen_key_LPF#1.1 U2_Pair_A_Sallen_key_LPF#1.2 U2_Pair_A_Sallen_key_LPF#1.6)
NetADC1_Pair_A_9: Pair_A (ADC1_Pair_A.9), Pair_A/Sallen_key_LPF (C19_Pair_A_Sallen_key_LPF#2.1 U2_Pair_A_Sallen_key_LPF#2.2 U2_Pair_A_Sallen_key_LPF#2.6)
NetADC1_Pair_A_10: Pair_A (ADC1_Pair_A.10), Pair_A/Single_channel_VMA2 (P1_Pair_A_Single_channel_VMA2.1 R2_Pair_A_Single_channel_VMA2.1 R3_Pair_A_Single_channel_VMA2.2), Pair_A/Sallen_key_LPF (C18_Pair_A_Sallen_key_LPF#2.2), Pair_A/Biasing_circuitry (U6_Pair_A_Biasing_circuitry#2.6)
NetADC1_Pair_A_18: Pair_A (ADC1_Pair_A.18), Pair_A/Biasing_circuitry (C13_Pair_A_Biasing_circuitry#2.2 U6_Pair_A_Biasing_circuitry#2.3)
NetADC1_Pair_A_23: Pair_A (ADC1_Pair_A.23), main_stack_dual_channel (MS1.12)
NetADC1_Pair_A_31: Pair_A (ADC1_Pair_A.31), main_stack_dual_channel (U3.3)
NetADC1_Pair_A_32: Pair_A (ADC1_Pair_A.32), main_stack_dual_channel (U3.2)
NetADC1_Pair_A_34: Pair_A (ADC1_Pair_A.34), main_stack_dual_channel (MS1.14)
NetADC1_Pair_A_35: Pair_A (ADC1_Pair_A.35), main_stack_dual_channel (MS1.13)
NetADC1_Pair_A_43: Pair_A (ADC1_Pair_A.43), Pair_A/Biasing_circuitry (C13_Pair_A_Biasing_circuitry#1.2 U6_Pair_A_Biasing_circuitry#1.3)
NetADC1_Pair_B_3: Pair_B (ADC1_Pair_B.3), Pair_B/Single_channel_VMA (P1_Pair_B_Single_channel_VMA.1 R2_Pair_B_Single_channel_VMA.1 R3_Pair_B_Single_channel_VMA.2), Pair_B/Sallen_key_LPF (C18_Pair_B_Sallen_key_LPF#1.2), Pair_B/Biasing_circuitry (U6_Pair_B_Biasing_circuitry#1.6)
NetADC1_Pair_B_4: Pair_B (ADC1_Pair_B.4), Pair_B/Sallen_key_LPF (C19_Pair_B_Sallen_key_LPF#1.1 U2_Pair_B_Sallen_key_LPF#1.2 U2_Pair_B_Sallen_key_LPF#1.6)
NetADC1_Pair_B_9: Pair_B (ADC1_Pair_B.9), Pair_B/Sallen_key_LPF (C19_Pair_B_Sallen_key_LPF#2.1 U2_Pair_B_Sallen_key_LPF#2.2 U2_Pair_B_Sallen_key_LPF#2.6)
NetADC1_Pair_B_10: Pair_B (ADC1_Pair_B.10), Pair_B/Single_channel_VMA2 (P1_Pair_B_Single_channel_VMA2.1 R2_Pair_B_Single_channel_VMA2.1 R3_Pair_B_Single_channel_VMA2.2), Pair_B/Sallen_key_LPF (C18_Pair_B_Sallen_key_LPF#2.2), Pair_B/Biasing_circuitry (U6_Pair_B_Biasing_circuitry#2.6)
NetADC1_Pair_B_18: Pair_B (ADC1_Pair_B.18), Pair_B/Biasing_circuitry (C13_Pair_B_Biasing_circuitry#2.2 U6_Pair_B_Biasing_circuitry#2.3)
NetADC1_Pair_B_23: Pair_B (ADC1_Pair_B.23), main_stack_dual_channel (MS1.18)
NetADC1_Pair_B_31: Pair_B (ADC1_Pair_B.31), main_stack_dual_channel (U3.5)
NetADC1_Pair_B_32: Pair_B (ADC1_Pair_B.32), main_stack_dual_channel (U3.4)
NetADC1_Pair_B_34: Pair_B (ADC1_Pair_B.34), main_stack_dual_channel (MS1.20)
NetADC1_Pair_B_35: Pair_B (ADC1_Pair_B.35), main_stack_dual_channel (MS1.19)
NetADC1_Pair_B_43: Pair_B (ADC1_Pair_B.43), Pair_B/Biasing_circuitry (C13_Pair_B_Biasing_circuitry#1.2 U6_Pair_B_Biasing_circuitry#1.3)
NetC25_2: main_stack_dual_channel (MS1.6), sonar_peripherals (C25.2 D2.2 R9.2 R10.2)
NetC26_2: main_stack_dual_channel (MS1.63), sonar_peripherals (C26.2 D3.2 R11.2 R13.2)
NetC27_2: main_stack_dual_channel (MS1.3), sonar_peripherals (C27.2 D4.2 R12.2 R14.2)
NetC28_2: main_stack_dual_channel (MS1.64), sonar_peripherals (C28.2 D5.2 R15.2 R17.2)
NetC29_2: main_stack_dual_channel (MS1.4), sonar_peripherals (C29.2 D6.2 R16.2 R18.2)
NetC30_2: main_stack_dual_channel (MS1.65), sonar_peripherals (C30.2 D7.2 R19.2 R20.2)
NetC31_2: main_stack_dual_channel (MS1.5), sonar_peripherals (C31.2 D8.2 R21.2 R22.2)
NetC32_2: main_stack_dual_channel (MS1.66), sonar_peripherals (C32.2 D9.2 R23.2 R24.2)
NetMS1_23: main_stack_dual_channel (MS1.23), sonar_peripherals (P4.2)
NetMS1_24: main_stack_dual_channel (MS1.24), sonar_peripherals (P4.4)
NetP4_3: main_stack_dual_channel (U3.6), sonar_peripherals (P4.3)
NetR1_Pair_A_Single_channel_VMA2_2: Pair_A/Single_channel_VMA2 (R1_Pair_A_Single_channel_VMA2.2 U1_Pair_A_Single_channel_VMA2.6), Pair_A/Sallen_key_LPF (R4_Pair_A_Sallen_key_LPF#2.1)
NetR1_Pair_A_Single_channel_VMA_2: Pair_A/Single_channel_VMA (R1_Pair_A_Single_channel_VMA.2 U1_Pair_A_Single_channel_VMA.6), Pair_A/Sallen_key_LPF (R4_Pair_A_Sallen_key_LPF#1.1)
NetR1_Pair_B_Single_channel_VMA2_2: Pair_B/Single_channel_VMA2 (R1_Pair_B_Single_channel_VMA2.2 U1_Pair_B_Single_channel_VMA2.6), Pair_B/Sallen_key_LPF (R4_Pair_B_Sallen_key_LPF#2.1)
NetR1_Pair_B_Single_channel_VMA_2: Pair_B/Single_channel_VMA (R1_Pair_B_Single_channel_VMA.2 U1_Pair_B_Single_channel_VMA.6), Pair_B/Sallen_key_LPF (R4_Pair_B_Sallen_key_LPF#1.1)